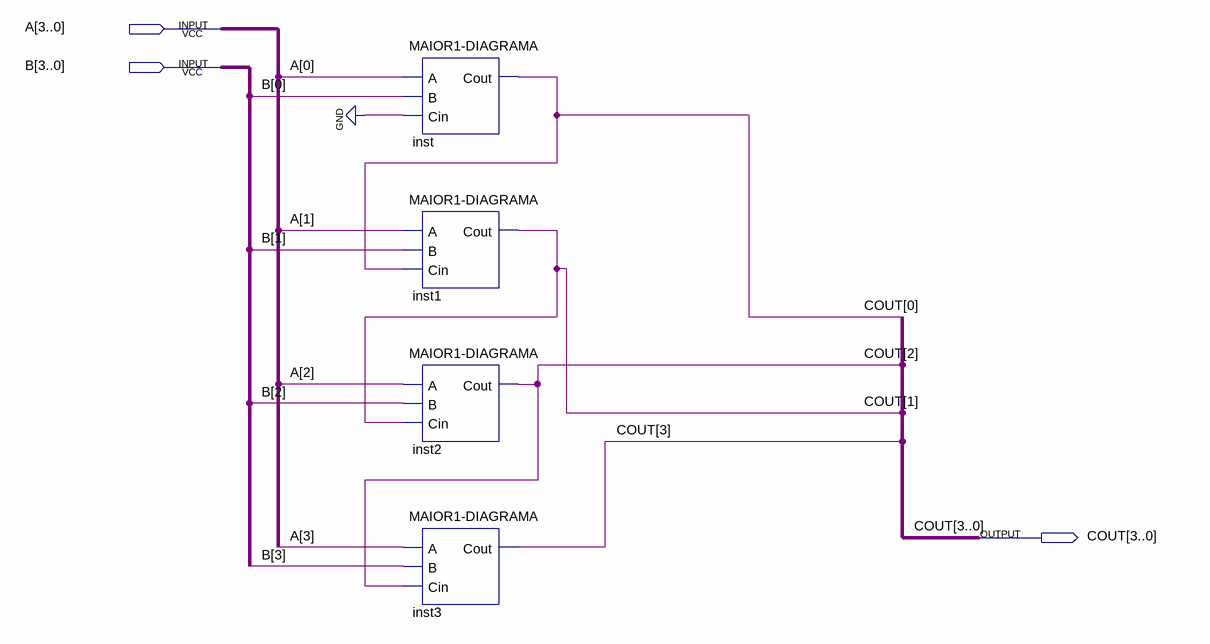
[diagram p0: schematic sheet]
// Quartus schematic MAIOR4-DIAGRAMA.bdf as structural Verilog: 4 symbols, 3 pins
module \MAIOR4-DIAGRAMA  (
  input  [3:0] A,
  input  [3:0] B,
  output [3:0] COUT
);

  \MAIOR1-DIAGRAMA  inst (.A(A[0]), .B(B[0]), .Cin(1'b0), .Cout(COUT[0]));
  \MAIOR1-DIAGRAMA  inst1 (.A(A[1]), .B(B[1]), .Cin(COUT[0]), .Cout(COUT[1]));
  \MAIOR1-DIAGRAMA  inst2 (.A(A[2]), .B(B[2]), .Cin(COUT[1]), .Cout(COUT[2]));
  \MAIOR1-DIAGRAMA  inst3 (.A(A[3]), .B(B[3]), .Cin(COUT[2]), .Cout(COUT[3]));
endmodule
